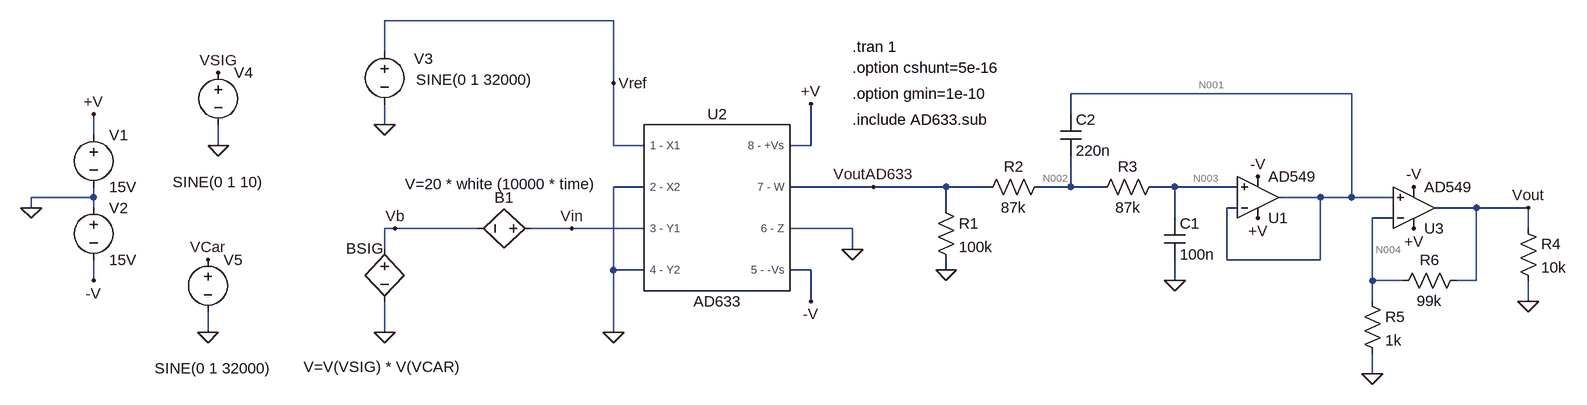
[diagram p0: schematic lockin_amp.asc]
lockin_amp.asc, the LTspice schematic file:
Version 4
SHEET 1 1572 844
WIRE -16 -48 -368 -48
WIRE -368 0 -368 -48
WIRE -16 48 -16 -48
WIRE 1120 64 688 64
WIRE 688 96 688 64
WIRE -368 112 -368 80
WIRE -816 128 -816 96
WIRE -624 144 -624 112
WIRE -16 144 -16 48
WIRE 32 144 -16 144
WIRE 288 144 288 80
WIRE 288 144 256 144
WIRE 32 208 -16 208
WIRE 384 208 256 208
WIRE 496 208 384 208
WIRE 560 208 496 208
WIRE 688 208 688 160
WIRE 688 208 640 208
WIRE 736 208 688 208
WIRE 848 208 816 208
WIRE 944 208 848 208
WIRE -816 224 -816 208
WIRE -816 224 -912 224
WIRE 1072 224 1008 224
WIRE 1120 224 1120 64
WIRE 1120 224 1072 224
WIRE 1184 224 1120 224
WIRE -912 240 -912 224
WIRE -816 240 -816 224
WIRE 496 240 496 208
WIRE 944 240 928 240
WIRE 1312 240 1248 240
WIRE 1392 240 1312 240
WIRE 848 256 848 208
WIRE 1184 256 1152 256
WIRE -352 272 -368 272
WIRE -224 272 -352 272
WIRE -80 272 -144 272
WIRE 32 272 -80 272
WIRE 352 272 256 272
WIRE 1392 272 1392 240
WIRE -368 304 -368 272
WIRE 352 304 352 272
WIRE 928 320 928 240
WIRE 1072 320 1072 224
WIRE 1072 320 928 320
WIRE -16 336 -16 208
WIRE 32 336 -16 336
WIRE 288 336 256 336
WIRE 496 336 496 320
WIRE -816 352 -816 320
WIRE 848 352 848 320
WIRE 1152 352 1152 256
WIRE 1200 352 1152 352
WIRE 1312 352 1312 240
WIRE 1312 352 1280 352
WIRE 288 384 288 336
WIRE 1152 384 1152 352
WIRE 1392 384 1392 352
WIRE -640 432 -640 400
WIRE -368 432 -368 384
WIRE -16 432 -16 336
WIRE 1152 496 1152 464
FLAG -816 96 +V
FLAG -816 352 -V
FLAG -912 240 0
FLAG 288 80 +V
FLAG 288 384 -V
FLAG -368 112 0
FLAG -16 432 0
FLAG 496 336 0
FLAG 848 352 0
FLAG 976 256 +V
FLAG 976 192 -V
FLAG 352 304 0
FLAG -624 144 0
FLAG -640 432 0
FLAG -368 432 0
FLAG -624 32 VSIG
FLAG -640 320 VCar
FLAG 1216 272 +V
FLAG 1216 208 -V
FLAG 1392 384 0
FLAG 1152 496 0
FLAG -80 272 Vin
FLAG -16 48 Vref
FLAG 384 208 VoutAD633
FLAG 1392 240 Vout
FLAG -352 272 Vb
SYMBOL voltage -816 112 R0
WINDOW 123 0 0 Left 0
WINDOW 39 0 0 Left 0
SYMATTR InstName V1
SYMATTR Value 15V
SYMBOL voltage -816 224 R0
WINDOW 123 0 0 Left 0
WINDOW 39 0 0 Left 0
SYMATTR InstName V2
SYMATTR Value 15V
SYMBOL voltage -368 -16 R0
WINDOW 123 0 0 Left 0
WINDOW 39 0 0 Left 0
WINDOW 0 45 26 Left 2
WINDOW 3 48 59 Left 2
SYMATTR InstName V3
SYMATTR Value SINE(0 1 32000)
SYMBOL res 480 224 R0
SYMATTR InstName R1
SYMATTR Value 100k
SYMBOL res 656 192 R90
WINDOW 0 0 56 VBottom 2
WINDOW 3 32 56 VTop 2
SYMATTR InstName R2
SYMATTR Value 87k
SYMBOL cap 832 256 R0
SYMATTR InstName C1
SYMATTR Value 100n
SYMBOL res 832 192 R90
WINDOW 0 0 56 VBottom 2
WINDOW 3 32 56 VTop 2
SYMATTR InstName R3
SYMATTR Value 87k
SYMBOL cap 672 96 R0
SYMATTR InstName C2
SYMATTR Value 220n
SYMBOL Opamps\\AD549 976 288 M180
SYMATTR InstName U1
SYMBOL bv -128 272 R90
WINDOW 0 -32 56 VBottom 2
WINDOW 3 -84 61 VTop 2
SYMATTR InstName B1
SYMATTR Value V=20 * white (10000 * time)
SYMBOL AD633 144 240 R0
SYMATTR InstName U2
SYMATTR Value AD633
SYMBOL bv -368 288 R0
WINDOW 0 -59 15 Left 2
WINDOW 3 -125 197 Left 2
SYMATTR InstName BSIG
SYMATTR Value V=V(VSIG) * V(VCAR)
SYMBOL voltage -624 16 R0
WINDOW 123 0 0 Left 0
WINDOW 39 0 0 Left 0
WINDOW 3 -70 184 Left 2
SYMATTR Value SINE(0 1 10)
SYMATTR InstName V4
SYMBOL voltage -640 304 R0
WINDOW 123 0 0 Left 0
WINDOW 39 0 0 Left 0
WINDOW 3 -82 183 Left 2
SYMATTR Value SINE(0 1 32000)
SYMATTR InstName V5
SYMBOL Opamps\\AD549 1216 304 M180
SYMATTR InstName U3
SYMBOL res 1376 256 R0
SYMATTR InstName R4
SYMATTR Value 10k
SYMBOL res 1136 368 R0
SYMATTR InstName R5
SYMATTR Value 1k
SYMBOL res 1296 336 R90
WINDOW 0 0 56 VBottom 2
WINDOW 3 32 56 VTop 2
SYMATTR InstName R6
SYMATTR Value 99k
TEXT 352 -8 Left 2 !.tran 1
TEXT 352 104 Left 2 !.include AD633.sub
TEXT 352 64 Left 2 !.option gmin=1e-10
TEXT 352 24 Left 2 !.option cshunt=5e-16

The netlist it stands for:
* lockin_amp.asc
V1 +V 0 15V
V2 0 -V 15V
V3 Vref 0 SINE(0 1 32000)
R1 VoutAD633 0 100k
R2 N002 VoutAD633 87k
C1 N003 0 100n
R3 N003 N002 87k
C2 N001 N002 220n
XU1 N003 N001 +V -V N001 AD549  ; pins In+ In- V+ V- OUT
B1 Vin Vb V=20 * white (10000 * time)
XU2 Vref 0 Vin 0 -V 0 VoutAD633 +V AD633 AD633  ; pins 1_-_X1 2_-_X2 3_-_Y1 4_-_Y2 5_-_-Vs 6_-_Z 7_-_W 8_-_+Vs
BSIG Vb 0 V=V(VSIG) * V(VCAR)
V4 VSIG 0 SINE(0 1 10)
V5 VCar 0 SINE(0 1 32000)
XU3 N001 N004 +V -V Vout AD549  ; pins In+ In- V+ V- OUT
R4 Vout 0 10k
R5 N004 0 1k
R6 Vout N004 99k
.tran 1
.include AD633.sub
.option gmin=1e-10
.option cshunt=5e-16
.lib AD633.sub
.backanno
.end

* Results of the author's LTspice run, read from the files saved beside the schematic
* Operating Point, zero values left out:
*   V(+v) = 15 V
*   V(-v) = -15 V
*   V(voutad633) = 3.806 mV
*   V(n002) = 3.806 mV
*   V(n003) = 3.806 mV
*   V(n001) = 3.804 mV
*   V(n004) = 3.799 mV
*   V(vout) = 379.9 mV
*   I(Bsig) = -800 nA
*   I(B1) = -800 nA
*   I(R6) = 3.799 µA
*   I(R5) = 3.799 µA
*   I(R4) = 37.99 µA
*   I(R1) = 38.06 nA
*   I(V3) = -800 nA
*   I(V2) = -5.649 mA
*   I(V1) = -5.692 mA